# Altium project ROVMainCotrol.PrjPcb
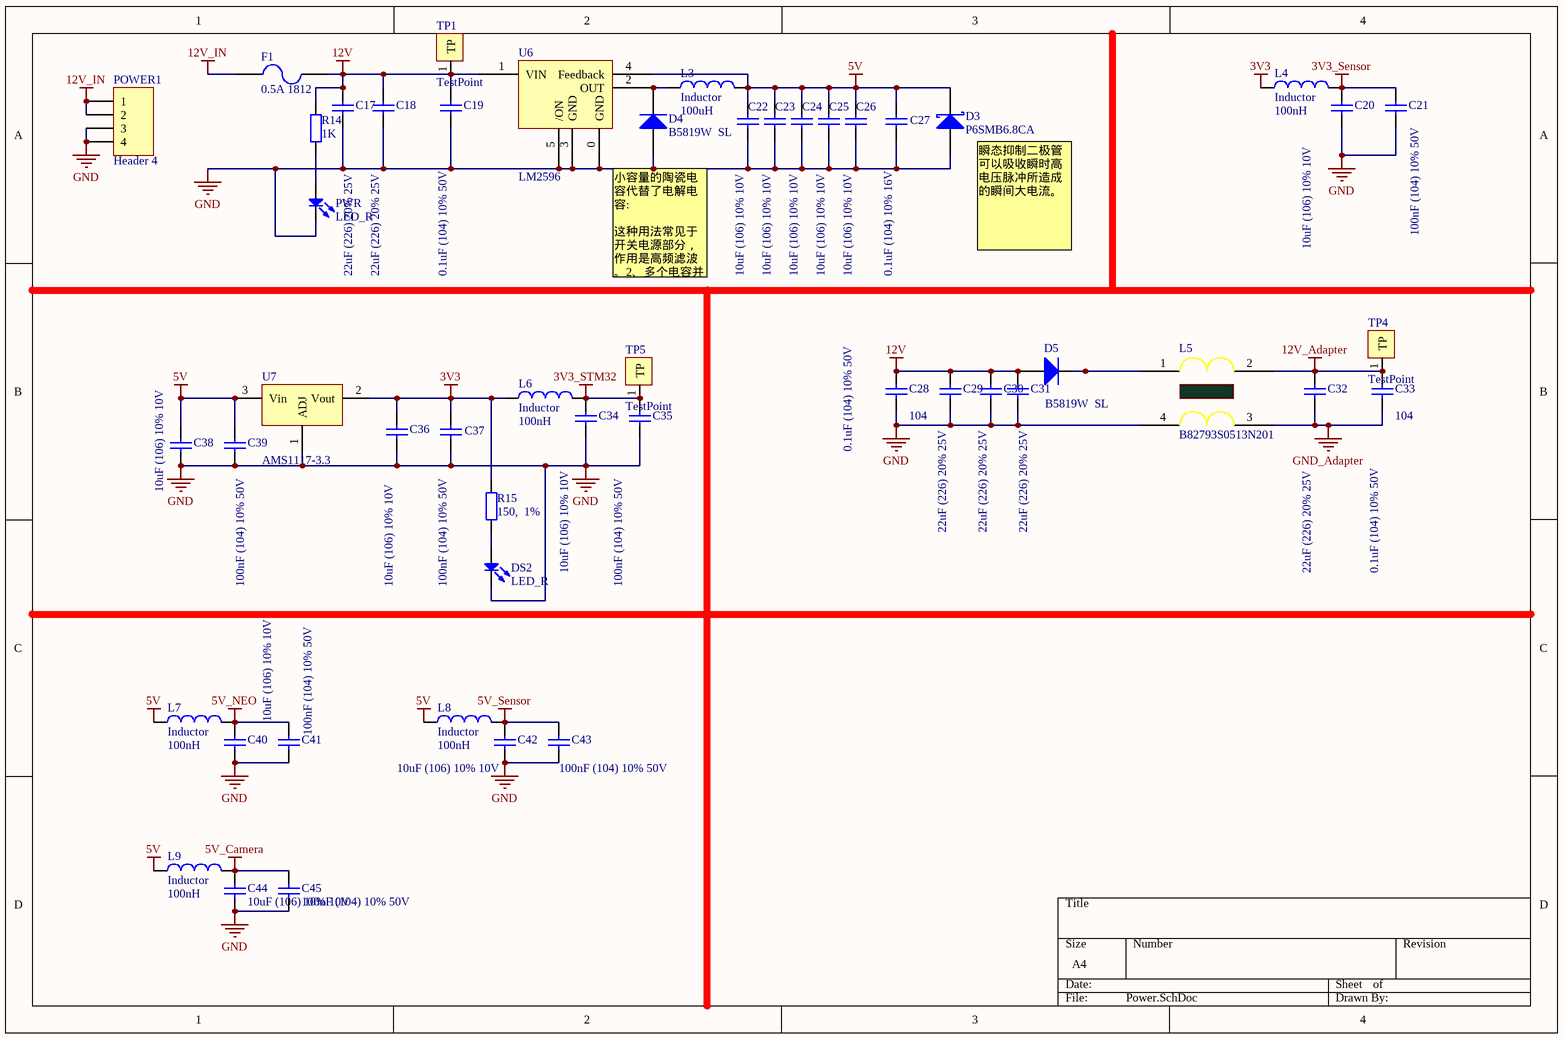
[diagram p0: Power.SchDoc]
6 sheets, 117 parts. Net scope: global (net labels, ports and power ports of the same name join across sheets).
Board file: ROVMainCotrol.PcbDoc
Sheets:
  Power.SchDoc
  LEDDriver.SchDoc
  MCU.SchDoc
  PLC_NanoPI.SchDoc
  PWM_Sensor.SchDoc
  State.SchDoc

## Sheet Power.SchDoc
size A4

### Parts
C17  22uF (226) 20% 25V  [0805_C]
C18  22uF (226) 20% 25V  [0805_C]
C19  0.1uF (104) 10% 50V  [0805_C]
C20  10uF (106) 10% 10V  [0603_C]
C21  100nF (104) 10% 50V  [0603_C]
C22  10uF (106) 10% 10V  [0603_C]
C23  10uF (106) 10% 10V  [0603_C]
C24  10uF (106) 10% 10V  [0603_C]
C25  10uF (106) 10% 10V  [0603_C]
C26  10uF (106) 10% 10V  [0603_C]
C27  0.1uF (104) 10% 16V  [0603_C]
C28  0.1uF (104) 10% 50V  value 104  [0805_C]
C29  22uF (226) 20% 25V  [0805_C]
C30  22uF (226) 20% 25V  [0805_C]
C31  22uF (226) 20% 25V  [0805_C]
C32  22uF (226) 20% 25V  [0805_C]
C33  0.1uF (104) 10% 50V  value 104  [0805_C]
C34  10uF (106) 10% 10V  [0603_C]
C35  100nF (104) 10% 50V  [0603_C]
C36  10uF (106) 10% 10V  [0603_C]
C37  100nF (104) 10% 50V  [0603_C]
C38  10uF (106) 10% 10V  [0603_C]
C39  100nF (104) 10% 50V  [0603_C]
C40  10uF (106) 10% 10V  [0603_C]
C41  100nF (104) 10% 50V  [0603_C]
C42  10uF (106) 10% 10V  [0603_C]
C43  100nF (104) 10% 50V  [0603_C]
C44  10uF (106) 10% 10V  [0603_C]
C45  100nF (104) 10% 50V  [0603_C]
D3  P6SMB6.8CA  [SMB(DO-214AA)_S1]
D4  B5819W  SL  [SOD-123]
D5  B5819W  SL  [SOD-123]
DS2  LED_R  [LED0603]
F1  0.5A 1812  [1812]
L3  Inductor  value 100uH  [L1050(10x10x4)]
L4  Inductor  value 100nH  [0603_L]
L5  B82793S0513N201  [B82793S0513N201_Yes]
L6  Inductor  value 100nH  [0603_L]
L7  Inductor  value 100nH  [0603_L]
L8  Inductor  value 100nH  [0603_L]
L9  Inductor  value 100nH  [0603_L]
POWER1  Header 4  [XH2.54_4P]
PWR  LED_R  [LED0603]
R14  1K  [R0603]
R15  150,  1%  [R0603]
TP1  TestPoint  [TP]
TP4  TestPoint  [TP]
TP5  TestPoint  [TP]
U6  LM2596
U7  AMS1117-3.3  [SOT-223]

### Nets
3V3: C36.2 C37.2 L4.1 L6.1 R15.1 U7.2(Vout)
3V3_Sensor: C20.2 C21.2 L4.2
3V3_STM32: C34.2 C35.2 L6.2 TP5.1(TP)
5V: C22.2 C23.2 C24.2 C25.2 C26.2 C27.2 C38.2 C39.2 D3.2(K) L3.2 L7.1 L8.1 L9.1 U6.4(Feedback) U7.3(Vin)
5V_Camera: C44.2 C45.2 L9.2
5V_NEO: C40.2 C41.2 L7.2
5V_Sensor: C42.2 C43.2 L8.2
12V: C17.2 C18.2 C19.2 C28.2 C29.2 C30.2 C31.2 D5.1(A) F1.2 R14.1 TP1.1(TP) U6.1(VIN)
12V_Adapter: C32.2 C33.2 L5.2 TP4.1(TP)
12V_IN: F1.1 POWER1.1 POWER1.2
GND: C17.1 C18.1 C19.1 C20.1 C21.1 C22.1 C23.1 C24.1 C25.1 C26.1 C27.1 C28.1 C29.1 C30.1 C31.1 C34.1 C35.1 C36.1 C37.1 C38.1 C39.1 C40.1 C41.1 C42.1 C43.1 C44.1 C45.1 D3.1(A) D4.1(A) DS2.2(K) L5.4 POWER1.3 POWER1.4 PWR.2(K) U6.0(GND) U6.3(GND) U6.5(/ON) U7.1(ADJ)
GND_Adapter: C32.1 C33.1 L5.3
NetD4_2: D4.2(K) L3.1 U6.2(OUT)
NetD5_2: D5.2(K) L5.1
NetDS2_1: DS2.1(A) R15.2
NetPWR_1: PWR.1(A) R14.2

### Notes on the sheet
- (near D3) 瞬态抑制二极管
  可以吸收瞬时高电压脉冲所造成的瞬间大电流。
- 小容量的陶瓷电容代替了电解电容:
  这种用法常见于开关电源部分，作用是高频滤波。2、多个电容并联主要是为了降低电容的等效阻抗，因为并联。3、用小容量的陶瓷电容代替了电解电容，增加了寿命。4、电解电容的寿命只有几千小时，而陶瓷电容的寿命有几十万小时。5、防止趋附效应的原理是增加导线的表面积。6、多个电容只能降低线路可靠性，而不可能增加。

### Library data of the parts
C17 C18 C29-C32 = 0805 22uF (226) 20% 25V: 贴片电容; ComponentLink1Description: 供应商链接; ComponentLink1URL: http://www.szlcsc.com/product/details_46786.html; Package: 0805; Supplier: LC; SuppliersPartNumber: C45783
C19 C27 C28 C33 = Cap: Capacitor; Published: 8-Jun-2000; LatestRevisionDate: 17-Jul-2002; LatestRevisionNote: Re-released for DXP Platform.; PackageReference: RAD-0.3; Publisher: Altium Limited; PackageDescription: Radial Cap, Thru-Hole; 2 Leads; 0.3 in Pin Spacing
C20 C22-C26 C34 C36 C38 C40 C42 C44 = 0603 10uF (106) 10% 10V: 贴片电容; ComponentLink1Description: 供应商链接; ComponentLink1URL: http://www.szlcsc.com/product/details_20411.html; Package: 0603; Supplier: LC; SuppliersPartNumber: C19702
C21 C35 C37 C39 C41 C43 C45 = 0603 100nF (104) 10% 50V: 贴片电容; ComponentLink1Description: 供应商链接; ComponentLink1URL: http://www.szlcsc.com/product/details_15331.html; Package: 0603; Supplier: LC; SuppliersPartNumber: C14663
D3 = D Schottky: Schottky Diode; Published: 8-Jun-2000; LatestRevisionDate: 17-Jul-2002; LatestRevisionNote: Re-released for DXP Platform.; PackageReference: SMB; Publisher: Altium Limited; PackageDescription: DO-214-AA/SMB; 2 C-Bend Leads; Body 5.3 x 3.6 mm, inc. leads (LxW); Code_JEDEC: DO-214-AA
D4 D5 = SOD-123 B5819W  SL: 肖特基二极管; ComponentLink1Description: 供应商链接; ComponentLink1URL: http://www.szlcsc.com/product/details_9093.html; Package: SOD-123; Supplier: LC; SuppliersPartNumber: C8598
DS2 PWR = LED: Typical RED, GREEN, YELLOW, AMBER GaAs LED; Published: 8-Jun-2000; LatestRevisionDate: 17-Jul-2002; LatestRevisionNote: Re-released for DXP Platform.; PackageDocument: Feb-2002; PackageReference: 3.2X1.6X1.1; Publisher: Altium Limited
F1 = Fuse 2: Fuse; Published: 8-Jun-2000; LatestRevisionDate: 17-Jul-2002; LatestRevisionNote: Re-released for DXP Platform.; PackageReference: PIN-W2/E2.8; Publisher: Altium Limited; PackageDescription: Thru-Hole; 2 Leads
L3 L4 L6-L9 = Inductor: Code_IEC: 1005; Published: 8-Jun-2000; LatestRevisionDate: 29-May-2009; LatestRevisionNote: IPC-7351 Footprint Added.; PackageReference: 0402-A; Publisher: Altium Limited; PackageDescription: Chip Inductor; Code_JEITA: 0402
POWER1 = Header 4: Header, 4-Pin; LatestRevisionDate: 17-Jul-2002; LatestRevisionNote: Re-released for DXP Platform.; Publisher: Altium Limited
R14 R15 = Res2: Resistor; Published: 8-Jun-2000; LatestRevisionDate: 17-Jul-2002; LatestRevisionNote: Re-released for DXP Platform.; Publisher: Altium Limited
TP1 TP4 TP5 = TP
U6 = LM2576
U7 = LM317: 3-Terminal Adjustable Positive Voltage Regulator

## Sheet LEDDriver.SchDoc
size A4
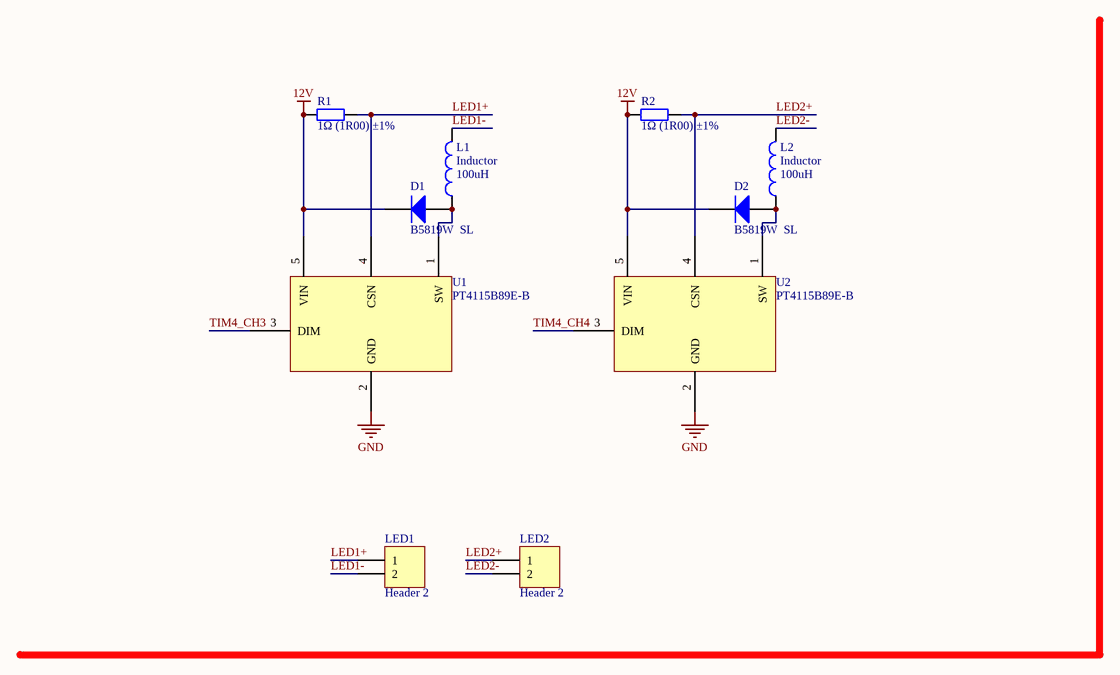
[diagram p1: LEDDriver.SchDoc]

### Parts
D1  B5819W  SL  [SOD-123]
D2  B5819W  SL  [SOD-123]
L1  Inductor  value 100uH  [L0630(6x7x3)]
L2  Inductor  value 100uH  [L0630(6x7x3)]
LED1  Header 2  [XH2.54_2P]
LED2  Header 2  [XH2.54_2P]
R1  1Ω (1R00) ±1%  [1206_R]
R2  1Ω (1R00) ±1%  [1206_R]
U1  PT4115B89E-B  [SOT89-150P420X160-5M]
U2  PT4115B89E-B  [SOT89-150P420X160-5M]

### Nets
12V: D1.2(K) D2.2(K) R1.1 R2.1 U1.5(VIN) U2.5(VIN)
GND: U1.2(GND) U2.2(GND)
LED1+: LED1.1 R1.2 U1.4(CSN)
LED1-: L1.2 LED1.2
LED2+: LED2.1 R2.2 U2.4(CSN)
LED2-: L2.2 LED2.2
TIM4_CH3: U1.3(DIM)
TIM4_CH4: U2.3(DIM)
NetD1_1: D1.1(A) L1.1 U1.1(SW)
NetD2_1: D2.1(A) L2.1 U2.1(SW)

### Library data of the parts
D1 D2 = SOD-123 B5819W  SL: 肖特基二极管; ComponentLink1Description: 供应商链接; ComponentLink1URL: http://www.szlcsc.com/product/details_9093.html; Package: SOD-123; Supplier: LC; SuppliersPartNumber: C8598
L1 L2 = Inductor: Code_IEC: 1005; Published: 8-Jun-2000; LatestRevisionDate: 29-May-2009; LatestRevisionNote: IPC-7351 Footprint Added.; PackageReference: 0402-A; Publisher: Altium Limited; PackageDescription: Chip Inductor; Code_JEITA: 0402
LED1 LED2 = Header 2: Header, 2-Pin; LatestRevisionDate: 17-Jul-2002; LatestRevisionNote: Re-released for DXP Platform.; Publisher: Altium Limited
R1 R2 = 1206 1Ω (1R00) 1%: 贴片电阻; ComponentLink1Description: 供应商链接; ComponentLink1URL: http://www.szlcsc.com/product/details_18616.html; Package: 1206; Supplier: LC; SuppliersPartNumber: C17928

## Sheet MCU.SchDoc
size A4
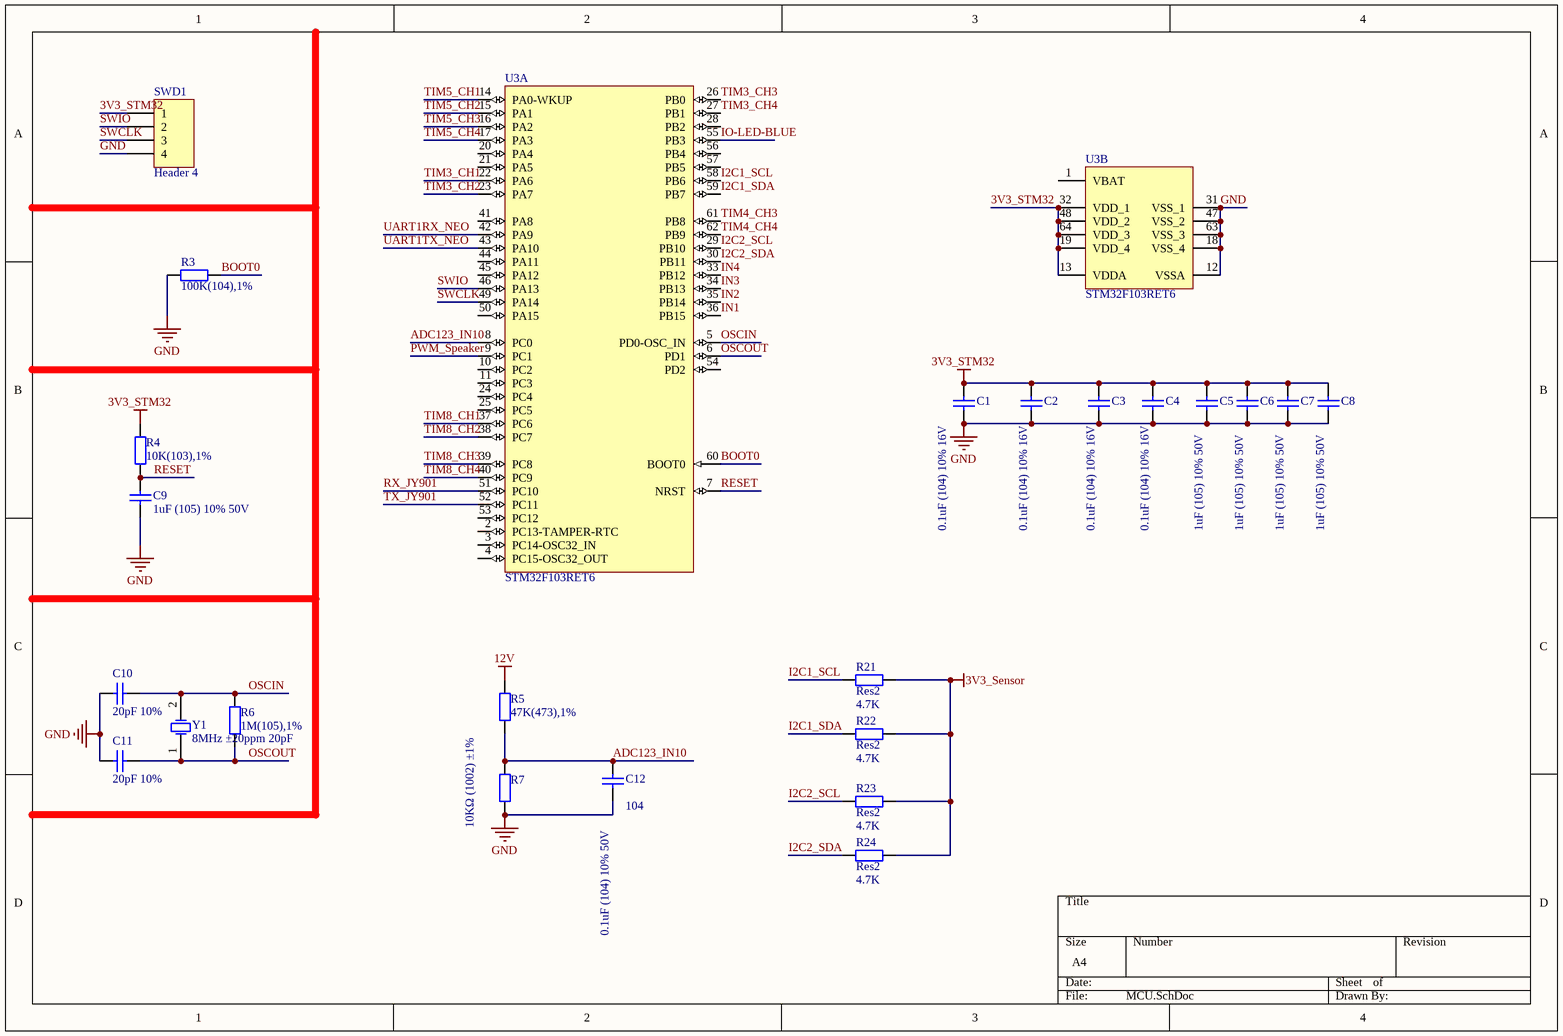
[diagram p2: MCU.SchDoc]

### Parts
C1  0.1uF (104) 10% 16V  [0603_C]
C2  0.1uF (104) 10% 16V  [0603_C]
C3  0.1uF (104) 10% 16V  [0603_C]
C4  0.1uF (104) 10% 16V  [0603_C]
C5  1uF (105) 10% 50V  [0603_C]
C6  1uF (105) 10% 50V  [0603_C]
C7  1uF (105) 10% 50V  [0603_C]
C8  1uF (105) 10% 50V  [0603_C]
C9  1uF (105) 10% 50V  [0603_C]
C10  20pF 10%  [0603_C]
C11  20pF 10%  [0603_C]
C12  0.1uF (104) 10% 50V  value 104  [0603_C]
R3  100K(104),1%  [0603_R]
R4  10K(103),1%  [0603_R]
R5  47K(473),1%  [0603_R]
R6  1M(105),1%  [0603_R]
R7  10KΩ (1002) ±1%  [0603_R]
R21  Res2  value 4.7K  [R0603]
R22  Res2  value 4.7K  [R0603]
R23  Res2  value 4.7K  [R0603]
R24  Res2  value 4.7K  [R0603]
SWD1  Header 4  [HDR1X4]
U3  STM32F103RET6  [LQFP-64_10x10x05P]  (parts A,B of 2)
Y1  8MHz ±20ppm 20pF  [SMD-5032_2P]

### Nets
3V3_Sensor: R21.2 R22.2 R23.2 R24.2
3V3_STM32: C1.2 C2.2 C3.2 C4.2 C5.2 C6.2 C7.2 C8.2 R4.2 SWD1.1 U3.13(VDDA) U3.19(VDD_4) U3.32(VDD_1) U3.48(VDD_2) U3.64(VDD_3)
12V: R5.2
GND: C1.1 C2.1 C3.1 C4.1 C5.1 C6.1 C7.1 C8.1 C9.1 C10.2 C11.2 C12.1 R3.1 R7.1 SWD1.4 U3.12(VSSA) U3.18(VSS_4) U3.31(VSS_1) U3.47(VSS_2) U3.63(VSS_3)
ADC123_IN10: C12.2 R5.1 R7.2 U3.8(PC0)
BOOT0: R3.2 U3.60(BOOT0)
I2C1_SCL: R21.1 U3.58(PB6)
I2C1_SDA: R22.1 U3.59(PB7)
I2C2_SCL: R23.1 U3.29(PB10)
I2C2_SDA: R24.1 U3.30(PB11)
IN1: U3.36(PB15)
IN2: U3.35(PB14)
IN3: U3.34(PB13)
IN4: U3.33(PB12)
IO-LED-BLUE: U3.55(PB3)
OSCIN: C10.1 R6.2 U3.5(PD0-OSC_IN) Y1.2(OSC2)
OSCOUT: C11.1 R6.1 U3.6(PD1) Y1.1(OSC1)
PWM_Speaker: U3.9(PC1)
RESET: C9.2 R4.1 U3.7(NRST)
RX_JY901: U3.51(PC10)
SWCLK: SWD1.3 U3.49(PA14)
SWIO: SWD1.2 U3.46(PA13)
TIM3_CH1: U3.22(PA6)
TIM3_CH2: U3.23(PA7)
TIM3_CH3: U3.26(PB0)
TIM3_CH4: U3.27(PB1)
TIM4_CH3: U3.61(PB8)
TIM4_CH4: U3.62(PB9)
TIM5_CH1: U3.14(PA0-WKUP)
TIM5_CH2: U3.15(PA1)
TIM5_CH3: U3.16(PA2)
TIM5_CH4: U3.17(PA3)
TIM8_CH1: U3.37(PC6)
TIM8_CH2: U3.38(PC7)
TIM8_CH3: U3.39(PC8)
TIM8_CH4: U3.40(PC9)
TX_JY901: U3.52(PC11)
UART1RX_NEO: U3.42(PA9)
UART1TX_NEO: U3.43(PA10)

Not connected (* = marked no-connect by the designer): U3 1(VBAT) 2(PC13-TAMPER-RTC) 3(PC14-OSC32_IN) 4(PC15-OSC32_OUT) 10(PC2) 11(PC3) 20(PA4) 21(PA5) 24(PC4) 25(PC5) 28(PB2) 41(PA8) 44(PA11) 45(PA12) 50(PA15) 53(PC12) 54(PD2) 56(PB4) 57(PB5)

### Library data of the parts
C1-C4 C10 C11 = Cap: Capacitor; Value: 104; Published: 8-Jun-2000; LatestRevisionDate: 17-Jul-2002; LatestRevisionNote: Re-released for DXP Platform.; Publisher: Altium Limited
C5-C8 = 0603 1uF (105) 10% 50V: 贴片电容; ComponentLink1Description: 供应商链接; ComponentLink1URL: http://www.szlcsc.com/product/details_16531.html; Package: 0603; Supplier: LC; SuppliersPartNumber: C15849
C9 = Cap: Capacitor; Value: 105; Published: 8-Jun-2000; LatestRevisionDate: 17-Jul-2002; LatestRevisionNote: Re-released for DXP Platform.; Publisher: Altium Limited
C12 = Cap: Capacitor; Published: 8-Jun-2000; LatestRevisionDate: 17-Jul-2002; LatestRevisionNote: Re-released for DXP Platform.; PackageReference: RAD-0.3; Publisher: Altium Limited; PackageDescription: Radial Cap, Thru-Hole; 2 Leads; 0.3 in Pin Spacing
R3-R6 R21-R24 = Res2: Resistor; Published: 8-Jun-2000; LatestRevisionDate: 17-Jul-2002; LatestRevisionNote: Re-released for DXP Platform.; Publisher: Altium Limited
  R21-R24: PackageReference: AXIAL-0.4; PackageDescription: Axial Device, Thru-Hole; 2 Leads; 0.4 in Pin Spacing
R7 = 0603 10KΩ (1002) 1%: 贴片电阻; ComponentLink1Description: 供应商链接; ComponentLink1URL: http://www.szlcsc.com/product/details_26547.html; Package: 0603; Supplier: LC; SuppliersPartNumber: C25804
SWD1 = Header 4: Header, 4-Pin; LatestRevisionDate: 17-Jul-2002; LatestRevisionNote: Re-released for DXP Platform.; Publisher: Altium Limited
U3 = STM32F103RET6: ARM; ComponentLink1Description: 供应商链接; ComponentLink1URL: http://www.szlcsc.com/product/details_8814.html; Package: LQFP-64_10x10x05P; Supplier: LC; SuppliersPartNumber: C8322
Y1 = SMD-5032_2P 8MHz 20ppm 20pF: 贴片晶振; ComponentLink1Description: 供应商链接; ComponentLink1URL: http://www.szlcsc.com/product/details_19261.html; Package: SMD-5032_2P; Supplier: LC; SuppliersPartNumber: C18560

## Sheet PLC_NanoPI.SchDoc
size A4
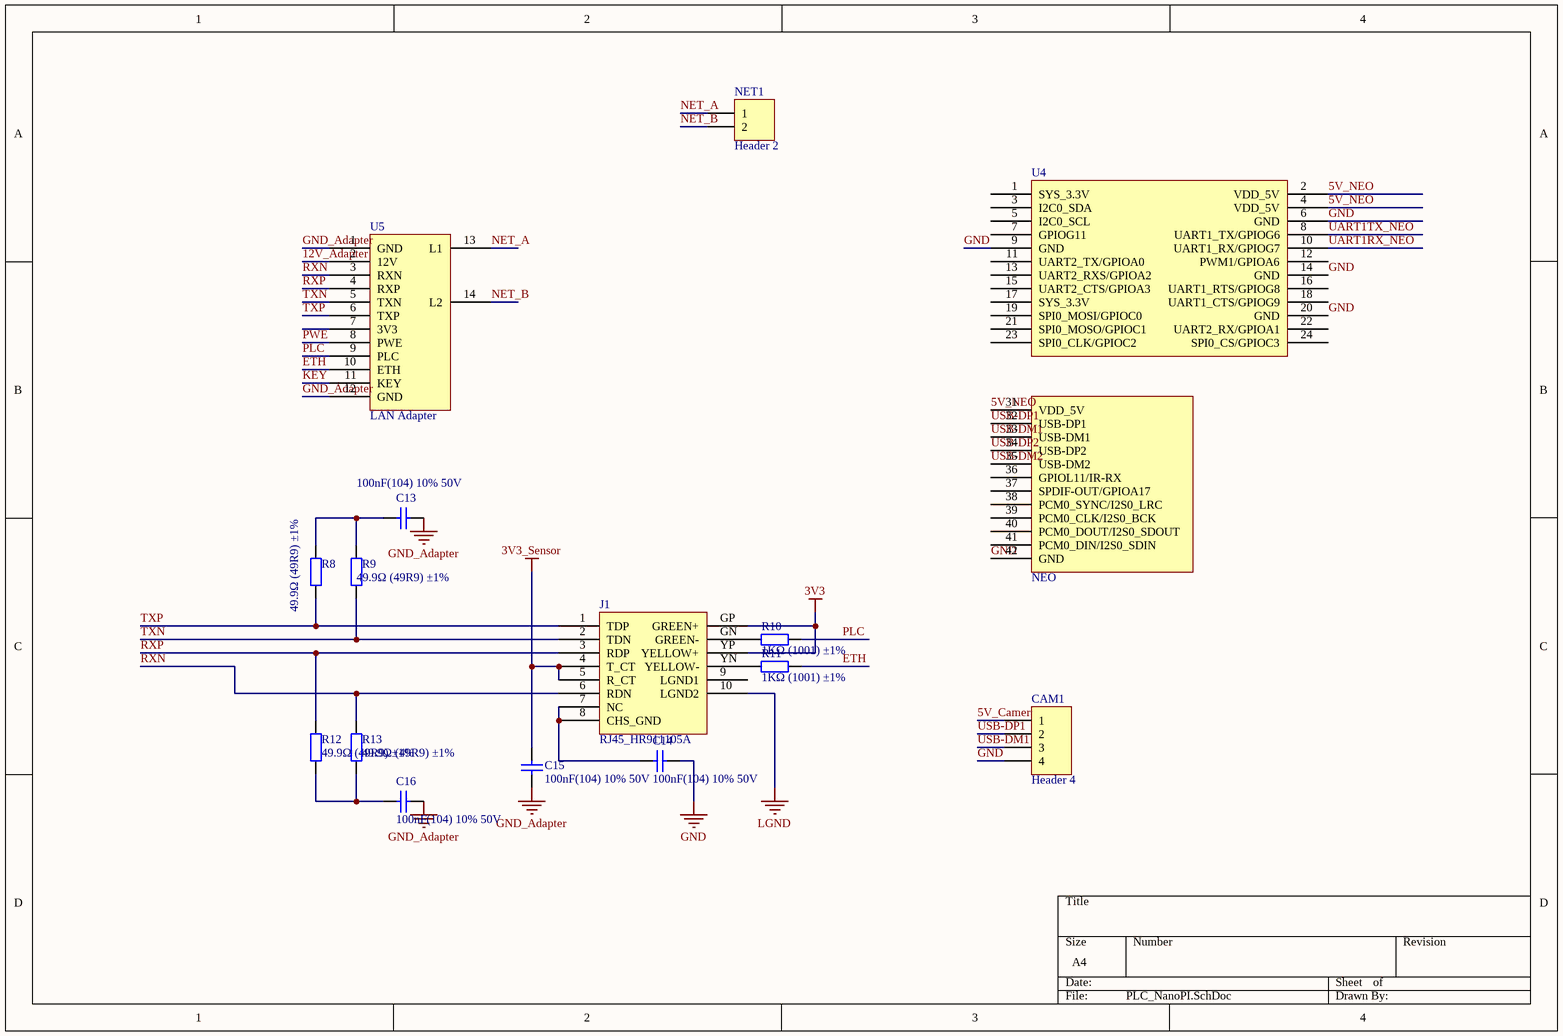
[diagram p3: PLC_NanoPI.SchDoc]

### Parts
C13  100nF(104) 10% 50V  [0603_C]
C14  100nF(104) 10% 50V  [0603-cap]
C15  100nF(104) 10% 50V  [0603_C]
C16  100nF(104) 10% 50V  [0603_C]
CAM1  Header 4  [XH2.54_4P]
J1  RJ45_HR911105A  [RJ45_3]
NET1  Header 2  [XH2.54_2P]
R8  49.9Ω (49R9) ±1%  [0603_R]
R9  49.9Ω (49R9) ±1%  [0603_R]
R10  1KΩ (1001) ±1%  [0603_R]
R11  1KΩ (1001) ±1%  [0603_R]
R12  49.9Ω (49R9) ±1%  [0603_R]
R13  49.9Ω (49R9) ±1%  [0603_R]
U4  NEO  [NanoPiNEO]
U5  LAN Adapter  [LAN Adapter]

### Nets
3V3: J1.GP(GREEN+) J1.YP(YELLOW+)
3V3_Sensor: C15.2 J1.4(T_CT) J1.5(R_CT)
5V_Camera: CAM1.1
5V_NEO: U4.2(VDD_5V) U4.4(VDD_5V) U4.31(VDD_5V)
12V_Adapter: U5.2(12V)
GND: C14.1 CAM1.4 U4.6(GND) U4.9(GND) U4.14(GND) U4.20(GND) U4.42(GND)
GND_Adapter: C13.1 C15.1 C16.1 U5.1(GND) U5.12(GND)
LGND: J1.10(LGND2)
ETH: R11.2 U5.10(ETH)
KEY: U5.11(KEY)
NET_A: NET1.1 U5.13(L1)
NET_B: NET1.2 U5.14(L2)
PLC: R10.2 U5.9(PLC)
PWE: U5.8(PWE)
RXN: J1.6(RDN) R13.2 U5.3(RXN)
RXP: J1.3(RDP) R12.2 U5.4(RXP)
TXN: J1.2(TDN) R9.1 U5.5(TXN)
TXP: J1.1(TDP) R8.1 U5.6(TXP)
UART1RX_NEO: U4.10(UART1_RX/GPIOG7)
UART1TX_NEO: U4.8(UART1_TX/GPIOG6)
USB-DM1: CAM1.3 U4.33(USB-DM1)
USB-DM2: U4.35(USB-DM2)
USB-DP1: CAM1.2 U4.32(USB-DP1)
USB-DP2: U4.34(USB-DP2)
NetC13_2: C13.2 R8.2 R9.2
NetC14_2: C14.2 J1.7(NC) J1.8(CHS_GND)
NetC16_2: C16.2 R12.1 R13.1
NetJ1_GN: J1.GN(GREEN-) R10.1
NetJ1_YN: J1.YN(YELLOW-) R11.1

Not connected (* = marked no-connect by the designer): J1 9(LGND1); U4 1(SYS_3.3V) 3(I2C0_SDA) 5(I2C0_SCL) 7(GPIOG11) 11(UART2_TX/GPIOA0) 12(PWM1/GPIOA6) 13(UART2_RXS/GPIOA2) 15(UART2_CTS/GPIOA3) 16(UART1_RTS/GPIOG8) 17(SYS_3.3V) 18(UART1_CTS/GPIOG9) 19(SPI0_MOSI/GPIOC0) 21(SPI0_MOSO/GPIOC1) 22(UART2_RX/GPIOA1) 23(SPI0_CLK/GPIOC2) 24(SPI0_CS/GPIOC3) 36(GPIOL11/IR-RX) 37(SPDIF-OUT/GPIOA17) 38(PCM0_SYNC/I2S0_LRC) 39(PCM0_CLK/I2S0_BCK) 40(PCM0_DOUT/I2S0_SDOUT) 41(PCM0_DIN/I2S0_SDIN); U5 7(3V3)

### Library data of the parts
C13-C16 = 0805 100nF(104) 10% 50V: 贴片电容; ComponentLink1Description: 供应商链接; ComponentLink1URL: http://www.szlcsc.com/product/details_50686.html; Package: 0805; Supplier: LC; SuppliersPartNumber: C49678
CAM1 = Header 4: Header, 4-Pin; LatestRevisionDate: 17-Jul-2002; LatestRevisionNote: Re-released for DXP Platform.; Publisher: Altium Limited
NET1 = Header 2: Header, 2-Pin; LatestRevisionDate: 17-Jul-2002; LatestRevisionNote: Re-released for DXP Platform.; Publisher: Altium Limited
R8 R9 R12 R13 = 0805 49.9Ω (49R9) 1%: 贴片电阻; ComponentLink1Description: 供应商链接; ComponentLink1URL: http://www.szlcsc.com/product/details_18408.html; Package: 0805; Supplier: LC; SuppliersPartNumber: C17720
R10 R11 = 0603 1KΩ (1001) 1%: 贴片电阻; ComponentLink1Description: 供应商链接; ComponentLink1URL: http://www.szlcsc.com/product/details_21904.html; Package: 0603; Supplier: LC; SuppliersPartNumber: C21190
U4 = NanoPiNEO

## Sheet PWM_Sensor.SchDoc
size A4
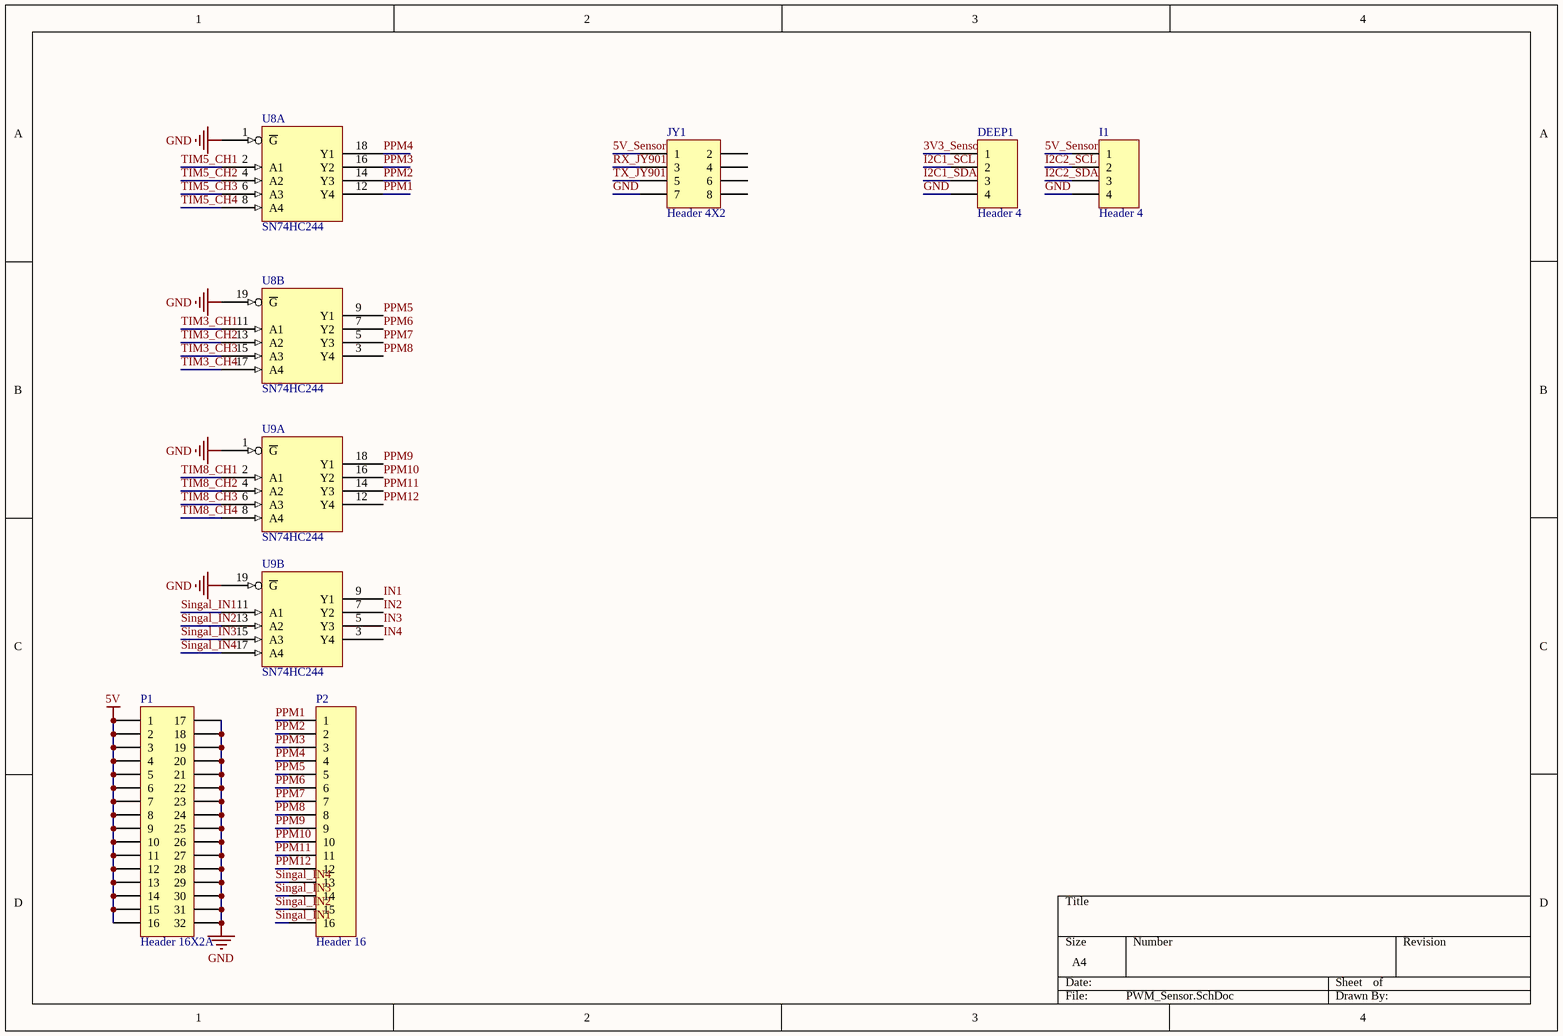
[diagram p4: PWM_Sensor.SchDoc]

### Parts
DEEP1  Header 4  [XH2.54_4P]
I1  Header 4  [XH2.54_4P]
JY1  Header 4X2  [JY901_2]
P1  Header 16X2A  [HDR2X16_CEN]
P2  Header 16  [HDR1X16]
U8  SN74HC244  [SOIC-20_300mil]  (parts A,B of 2)
U9  SN74HC244  [SOIC-20_300mil]  (parts A,B of 2)

### Nets
3V3: U8.20(VCC) U9.20(VCC)
3V3_Sensor: DEEP1.1
5V: P1.1 P1.2 P1.3 P1.4 P1.5 P1.6 P1.7 P1.8 P1.9 P1.10 P1.11 P1.12 P1.13 P1.14 P1.15 P1.16
5V_Sensor: I1.1 JY1.1
GND: DEEP1.4 I1.4 JY1.7 P1.17 P1.18 P1.19 P1.20 P1.21 P1.22 P1.23 P1.24 P1.25 P1.26 P1.27 P1.28 P1.29 P1.30 P1.31 P1.32 U8.1(~{G}) U8.10(GND) U8.19(~{G}) U9.1(~{G}) U9.10(GND) U9.19(~{G})
I2C1_SCL: DEEP1.2
I2C1_SDA: DEEP1.3
I2C2_SCL: I1.2
I2C2_SDA: I1.3
IN1: U9.9(Y1)
IN2: U9.7(Y2)
IN3: U9.5(Y3)
IN4: U9.3(Y4)
PPM1: P2.1 U8.12(Y4)
PPM2: P2.2 U8.14(Y3)
PPM3: P2.3 U8.16(Y2)
PPM4: P2.4 U8.18(Y1)
PPM5: P2.5 U8.9(Y1)
PPM6: P2.6 U8.7(Y2)
PPM7: P2.7 U8.5(Y3)
PPM8: P2.8 U8.3(Y4)
PPM9: P2.9 U9.18(Y1)
PPM10: P2.10 U9.16(Y2)
PPM11: P2.11 U9.14(Y3)
PPM12: P2.12 U9.12(Y4)
RX_JY901: JY1.3
Singal_IN1: P2.16 U9.11(A1)
Singal_IN2: P2.15 U9.13(A2)
Singal_IN3: P2.14 U9.15(A3)
Singal_IN4: P2.13 U9.17(A4)
TIM3_CH1: U8.11(A1)
TIM3_CH2: U8.13(A2)
TIM3_CH3: U8.15(A3)
TIM3_CH4: U8.17(A4)
TIM5_CH1: U8.2(A1)
TIM5_CH2: U8.4(A2)
TIM5_CH3: U8.6(A3)
TIM5_CH4: U8.8(A4)
TIM8_CH1: U9.2(A1)
TIM8_CH2: U9.4(A2)
TIM8_CH3: U9.6(A3)
TIM8_CH4: U9.8(A4)
TX_JY901: JY1.5

Not connected (* = marked no-connect by the designer): JY1 2 4 6 8

### Library data of the parts
DEEP1 I1 = Header 4: Header, 4-Pin; LatestRevisionDate: 17-Jul-2002; LatestRevisionNote: Re-released for DXP Platform.; Publisher: Altium Limited
JY1 = Header 4X2: Header, 4-Pin, Dual row; LatestRevisionDate: 17-Jul-2002; LatestRevisionNote: Re-released for DXP Platform.; Publisher: Altium Limited
P1 = Header 16X2A: Header, 16-Pin, Dual row; LatestRevisionDate: 17-Jul-2002; LatestRevisionNote: Re-released for DXP Platform.; Publisher: Altium Limited
P2 = Header 16: Header, 16-Pin; LatestRevisionDate: 17-Jul-2002; LatestRevisionNote: Re-released for DXP Platform.; Publisher: Altium Limited
U8 U9 = SN74HC244: OCTAL BUF AND LIN DRV 3SO

## Sheet State.SchDoc
size A4
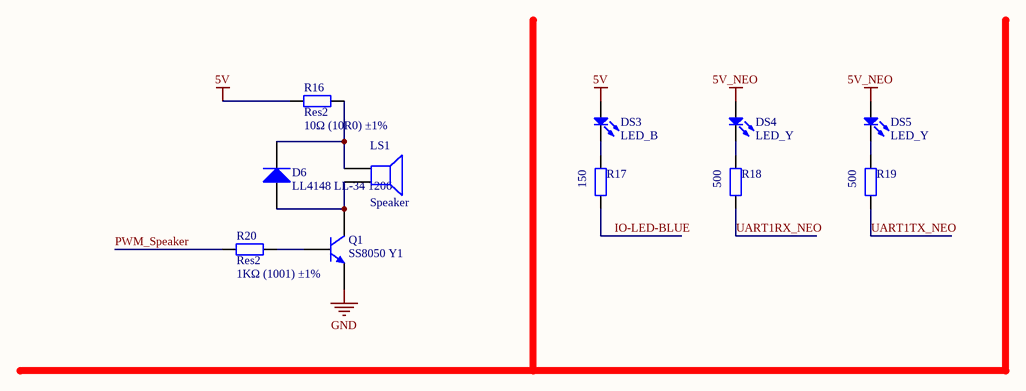
[diagram p5: State.SchDoc]

### Parts
D6  LL4148 LL-34 1206  [LL-34]
DS3  LED_B  [LED0603]
DS4  LED_Y  [LED0603]
DS5  LED_Y  [LED0603]
LS1  Speaker  [MLT-5030]
Q1  SS8050 Y1  [SOT-23(SOT-23-3)]
R16  Res2  value 10Ω (10R0) ±1%  [R1206]
R17  150  [R0603]
R18  500  [R0603]
R19  500  [R0603]
R20  Res2  value 1KΩ (1001) ±1%  [R0603]

### Nets
5V: DS3.1(A) R16.1
5V_NEO: DS4.1(A) DS5.1(A)
GND: Q1.2(E)
IO-LED-BLUE: R17.2
PWM_Speaker: R20.1
UART1RX_NEO: R18.2
UART1TX_NEO: R19.2
NetD6_1: D6.1(A) LS1.2 Q1.3(C)
NetD6_2: D6.2(K) LS1.1 R16.2
NetDS3_2: DS3.2(K) R17.1
NetDS4_2: DS4.2(K) R18.1
NetDS5_2: DS5.2(K) R19.1
NetQ1_1: Q1.1(B) R20.2

### Library data of the parts
D6 = LL-34 LL4148 LL-34 1206: 开关二极管; ComponentLink1Description: 供应商链接; ComponentLink1URL: http://www.szlcsc.com/product/details_10338.html; Package: LL-34; Supplier: LC; SuppliersPartNumber: C9808
DS3-DS5 = LED: as DS2 on sheet Power; Published: 8-Jun-2000; LatestRevisionDate: 17-Jul-2002; LatestRevisionNote: Re-released for DXP Platform.; PackageDocument: Feb-2002; PackageReference: 3.2X1.6X1.1; Publisher: Altium Limited
LS1 = Speaker: Loudspeaker; Published: 24-Mar-1999; LatestRevisionDate: 17-Jul-2002; LatestRevisionNote: Re-released for DXP Platform.; PackageReference: PIN2; Publisher: Altium Limited
Q1 = SOT-23 SS8050 Y1: 三极管; ComponentLink1Description: 供应商链接; ComponentLink1URL: http://www.szlcsc.com/product/details_2507.html; Package: SOT-23; Supplier: LC; SuppliersPartNumber: C2150
R16-R20 = Res2: Resistor; Published: 8-Jun-2000; LatestRevisionDate: 17-Jul-2002; LatestRevisionNote: Re-released for DXP Platform.; Publisher: Altium Limited
  R16 R20: PackageReference: AXIAL-0.4; PackageDescription: Axial Device, Thru-Hole; 2 Leads; 0.4 in Pin Spacing

## Nets that join several sheets
3V3: Power (6 pins), PLC_NanoPI (J1.GP J1.YP), PWM_Sensor (U8.20 U9.20)
3V3_Sensor: Power (C20.2 C21.2 L4.2), MCU (R21.2 R22.2 R23.2 R24.2), PLC_NanoPI (C15.2 J1.4 J1.5), PWM_Sensor (DEEP1.1)
3V3_STM32: Power (C34.2 C35.2 L6.2 TP5.1), MCU (15 pins)
5V: Power (15 pins), PWM_Sensor (16 pins), State (DS3.1 R16.1)
5V_Camera: Power (C44.2 C45.2 L9.2), PLC_NanoPI (CAM1.1)
5V_NEO: Power (C40.2 C41.2 L7.2), PLC_NanoPI (U4.2 U4.4 U4.31), State (DS4.1 DS5.1)
5V_Sensor: Power (C42.2 C43.2 L8.2), PWM_Sensor (I1.1 JY1.1)
12V: Power (12 pins), LEDDriver (6 pins), MCU (R5.2)
12V_Adapter: Power (C32.2 C33.2 L5.2 TP4.1), PLC_NanoPI (U5.2)
GND: Power (38 pins), LEDDriver (U1.2 U2.2), MCU (20 pins), PLC_NanoPI (7 pins), PWM_Sensor (25 pins), State (Q1.2)
GND_Adapter: Power (C32.1 C33.1 L5.3), PLC_NanoPI (5 pins)
I2C1_SCL: MCU (R21.1 U3.58), PWM_Sensor (DEEP1.2)
I2C1_SDA: MCU (R22.1 U3.59), PWM_Sensor (DEEP1.3)
I2C2_SCL: MCU (R23.1 U3.29), PWM_Sensor (I1.2)
I2C2_SDA: MCU (R24.1 U3.30), PWM_Sensor (I1.3)
IN1: MCU (U3.36), PWM_Sensor (U9.9)
IN2: MCU (U3.35), PWM_Sensor (U9.7)
IN3: MCU (U3.34), PWM_Sensor (U9.5)
IN4: MCU (U3.33), PWM_Sensor (U9.3)
IO-LED-BLUE: MCU (U3.55), State (R17.2)
PWM_Speaker: MCU (U3.9), State (R20.1)
RX_JY901: MCU (U3.51), PWM_Sensor (JY1.3)
TIM3_CH1: MCU (U3.22), PWM_Sensor (U8.11)
TIM3_CH2: MCU (U3.23), PWM_Sensor (U8.13)
TIM3_CH3: MCU (U3.26), PWM_Sensor (U8.15)
TIM3_CH4: MCU (U3.27), PWM_Sensor (U8.17)
TIM4_CH3: LEDDriver (U1.3), MCU (U3.61)
TIM4_CH4: LEDDriver (U2.3), MCU (U3.62)
TIM5_CH1: MCU (U3.14), PWM_Sensor (U8.2)
TIM5_CH2: MCU (U3.15), PWM_Sensor (U8.4)
TIM5_CH3: MCU (U3.16), PWM_Sensor (U8.6)
TIM5_CH4: MCU (U3.17), PWM_Sensor (U8.8)
TIM8_CH1: MCU (U3.37), PWM_Sensor (U9.2)
TIM8_CH2: MCU (U3.38), PWM_Sensor (U9.4)
TIM8_CH3: MCU (U3.39), PWM_Sensor (U9.6)
TIM8_CH4: MCU (U3.40), PWM_Sensor (U9.8)
TX_JY901: MCU (U3.52), PWM_Sensor (JY1.5)
UART1RX_NEO: MCU (U3.42), PLC_NanoPI (U4.10), State (R18.2)
UART1TX_NEO: MCU (U3.43), PLC_NanoPI (U4.8), State (R19.2)